# EAGLE design main_module.0.1 (EAGLE 7.7.0)
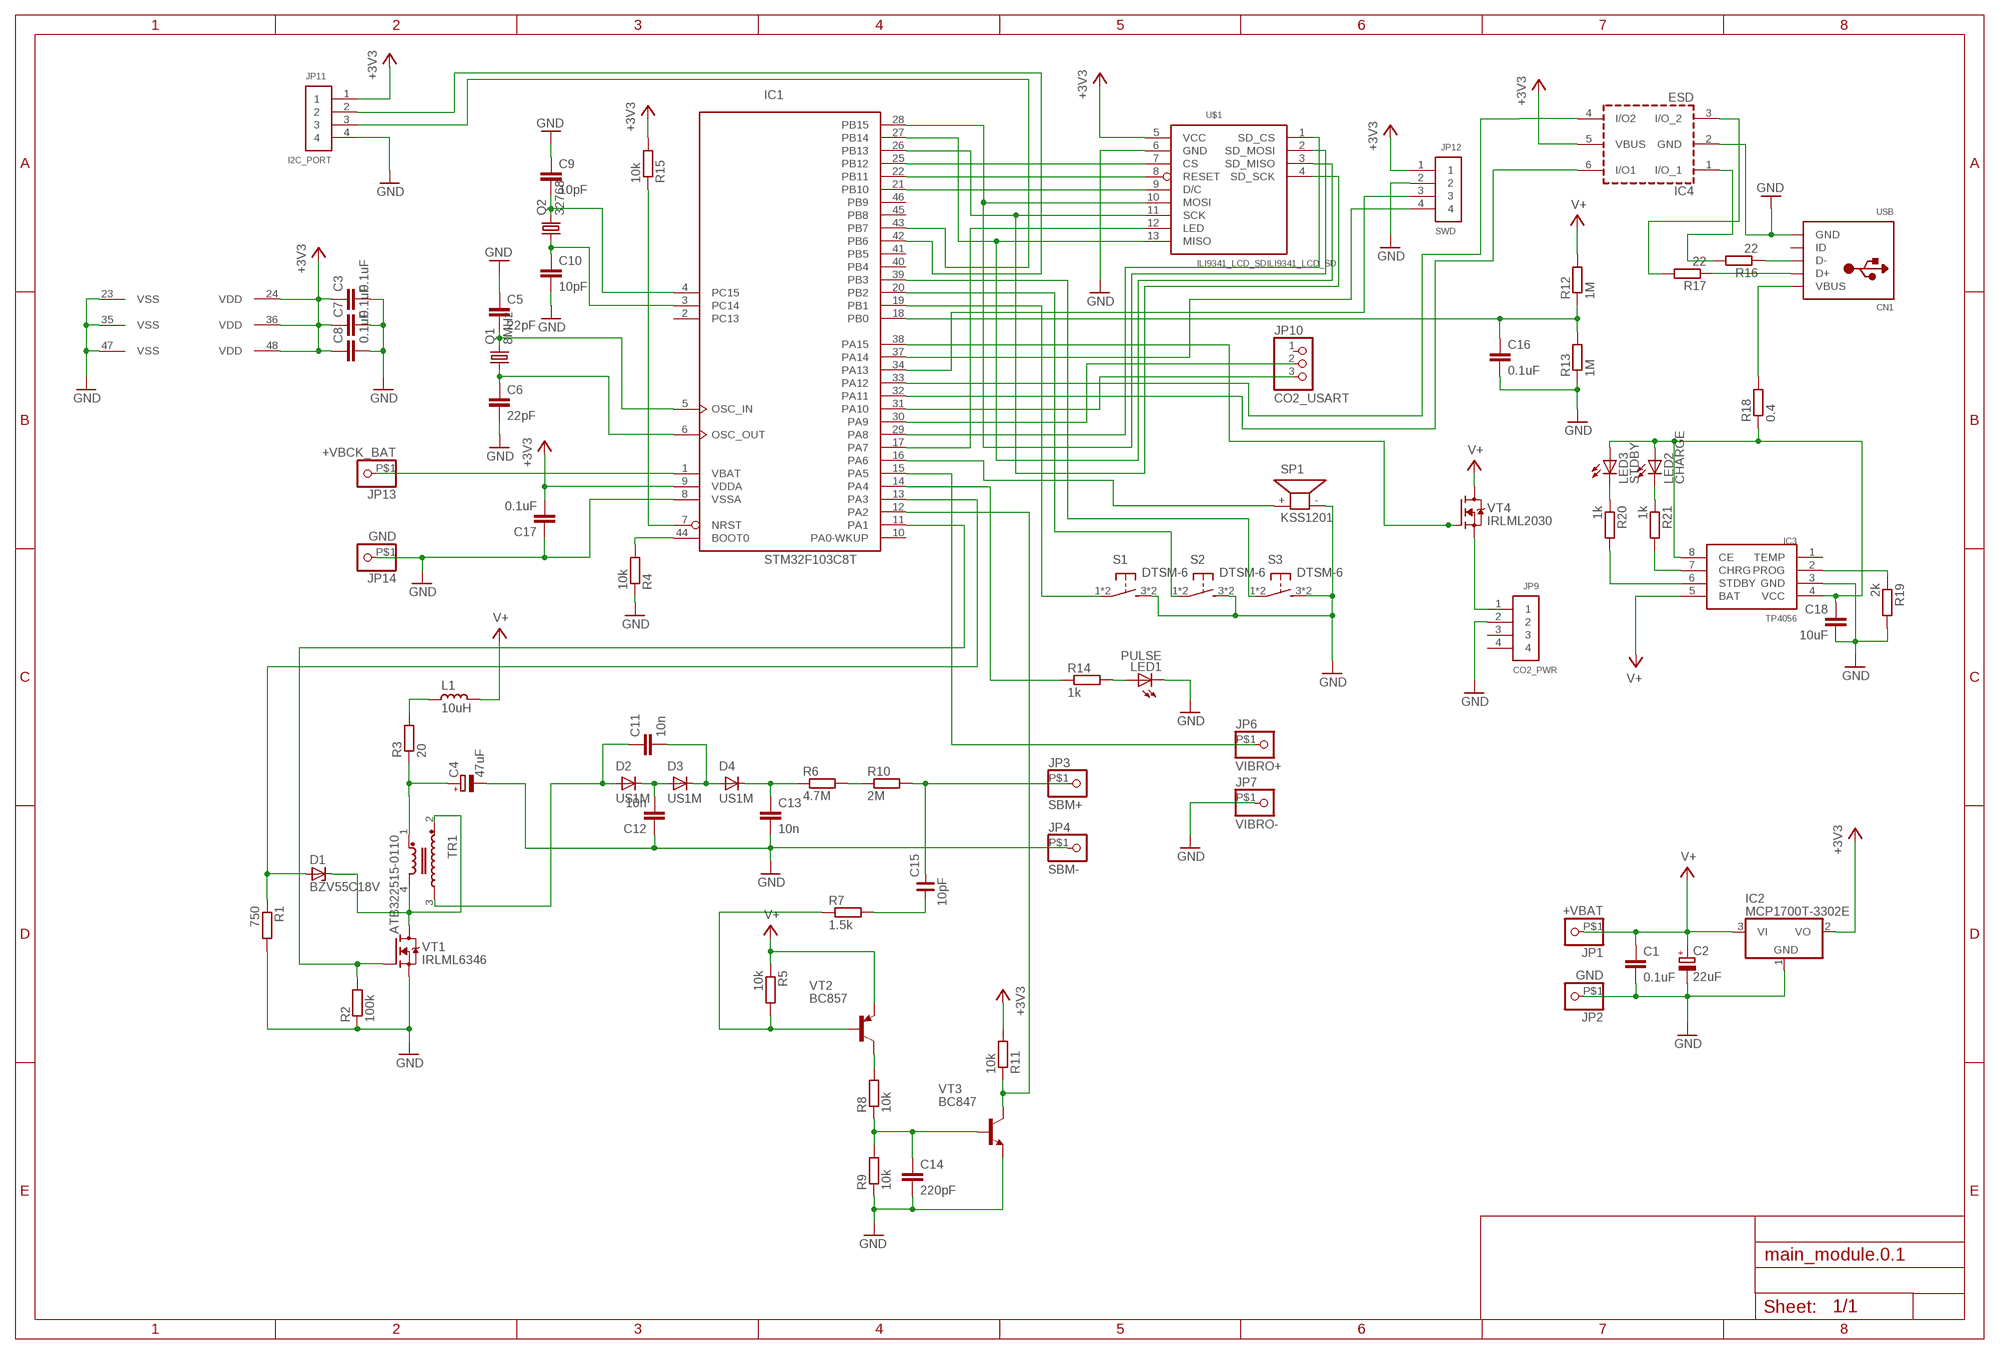
[diagram p0: schematic, sheet 1]

## Parts
C1  0.1uF  C-EUC0805  [C0805]
C2  22uF  CPOL-EUC/6032-28R  [C/6032-28R]
C3  0.1uF  C-EUC0805  [C0805]
C4  47uF  CPOL-EUC/6032-28R  [C/6032-28R]
C5  22pF  C-EUC0805  [C0805]
C6  22pF  C-EUC0805  [C0805]
C7  0.1uF  C-EUC0805  [C0805]
C8  0.1uF  C-EUC0805  [C0805]
C9  10pF  C-EUC0805  [C0805]
C10  10pF  C-EUC0805  [C0805]
C11  10n  C-EUC1206  [C1206]
C12  10n  C-EUC1206  [C1206]
C13  10n  C-EUC1206  [C1206]
C14  220pF  C-EUC0805  [C0805]
C15  10pF  C_1206  [C1206]
C16  0.1uF  C-EUC0805  [C0805]
C17  0.1uF  C-EUC0805  [C0805]
C18  10uF  C-EUC0805  [C0805]
CN1  USB  USBMINIB  [USB-MINIB]
D1  BZV55C18V  ZENER-DIODESOD80C  [SOD80C]
D2  US1M  GF1  [SMA-DO214AC]
D3  US1M  GF1  [SMA-DO214AC]
D4  US1M  GF1  [SMA-DO214AC]
IC1  STM32F103C8T  [LQFP48]
IC2  MCP1700T-3302E  MCP1703CB  [SOT23]
IC3  TP4056  [SOP-8]
IC4  ESD  USBLC6-2SC6  [SOT-23-6L]
JP1  +VBAT  PINHD-1X1-BIGPOGO  [1X1-BIGPOGO]
JP2  GND  PINHD-1X1-BIGPOGO  [1X1-BIGPOGO]
JP3  SBM+  PINHD-1X1-BIGPOGO  [1X1-BIGPOGO]
JP4  SBM-  PINHD-1X1-BIGPOGO  [1X1-BIGPOGO]
JP6  VIBRO+  PINHD-1X1-BIGPOGO  [1X1-BIGPOGO]
JP7  VIBRO-  PINHD-1X1-BIGPOGO  [1X1-BIGPOGO]
JP9  CO2_PWR  1X4-BIG  [1X04-BIG]
JP10  CO2_USART  PINHD-1X3  [1X03]
JP11  I2C_PORT  1X4-BIG  [1X04-BIG]
JP12  SWD  1X4-BIG  [1X04-BIG]
JP13  +VBCK_BAT  PINHD-1X1-BIGPOGO  [1X1-BIGPOGO]
JP14  GND  PINHD-1X1-BIGPOGO  [1X1-BIGPOGO]
L1  10uH  L_0805  [L0805]
LED1  PULSE  LED3MM  [LED3MM]
LED2  CHARGE  LEDCHIP-LED0805  [CHIP-LED0805]
LED3  STDBY  LEDCHIP-LED0805  [CHIP-LED0805]
Q1  8MHz  CRYSTALHC49S  [HC49/S]
Q2  32768  CRYSTALHC49S  [HC49/S]
R1  750  R-EU_M0805  [M0805]
R2  100k  R-EU_M0805  [M0805]
R3  20  R-EU_M0805  [M0805]
R4  10k  R-EU_M0805  [M0805]
R5  10k  R-EU_M0805  [M0805]
R6  4.7M  R-EU_M0805  [M0805]
R7  1.5k  R-EU_M0805  [M0805]
R8  10k  R-EU_M0805  [M0805]
R9  10k  R-EU_M0805  [M0805]
R10  2M  R-EU_M0805  [M0805]
R11  10k  R-EU_M0805  [M0805]
R12  1M  R-EU_M0805  [M0805]
R13  1M  R-EU_M0805  [M0805]
R14  1k  R-EU_M0805  [M0805]
R15  10k  R-EU_M0805  [M0805]
R16  22  R-EU_M0805  [M0805]
R17  22  R-EU_M0805  [M0805]
R18  0.4  R-EU_M1206  [M1206]
R19  2k  R-EU_M0805  [M0805]
R20  1k  R-EU_M0805  [M0805]
R21  1k  R-EU_M0805  [M0805]
S1  DTSM-6  [DTSM-6]
S2  DTSM-6  [DTSM-6]
S3  DTSM-6  [DTSM-6]
SP1  KSS1201  [KSS1201]
TR1  ATB322515-0110  ATB3225  [ATB3225]
U$1  ILI9341_LCD_SDILI9341_LCD_SD  [ILI9341_LCD_SD]
VT1  IRLML6346  MOSFET-N-SOT23  [SOT23]
VT2  BC857  -PNP-SOT23-BCE  [SOT23-BCE]
VT3  BC847  [SOT23]
VT4  IRLML2030  MOSFET-N-SOT23  [SOT23]

## Nets
32OSC_IN: C9.2 IC1.4(PC15) Q2.2
32OSC_OUT: C10.1 IC1.3(PC14) Q2.1
+3V3: C3.1 C7.1 C8.1 C17.2 IC1.9(VDDA) IC1.24(VDD) IC1.36(VDD) IC1.48(VDD) IC2.2(VO) IC4.5(VBUS) JP11.1 JP12.1 R11.2 R15.2 U$1.5(VCC)
+VBCK_BAT: IC1.1(VBAT) JP13.P$1
BATT_CTRL: C16.1 IC1.18(PB0) R12.1 R13.2
CO2_PWR_CONTROL: IC1.38(PA15) VT4.1(G)
GND [power]: C1.2 C2.- C3.2 C4.- C5.1 C6.2 C7.2 C8.2 C9.1 C10.2 C12.1 C13.2 C14.2 C16.2 C17.1 C18.2 CN1.GND IC1.8(VSSA) IC1.23(VSS) IC1.35(VSS) IC1.47(VSS) IC2.1(GND) IC3.3(GND) IC4.2(GND) JP2.P$1 JP4.P$1 JP7.P$1 JP9.2 JP11.4 JP12.2 JP14.P$1 LED1.K(C) R1.2 R2.1 R4.1 R9.1 R13.1 R19.2 S1.3 S1.4 S2.3 S2.4 S3.3 S3.4 SP1.- U$1.6(GND) VT1.2(S) VT3.2(E)
HV_MUL_IN: C11.1 D2.A TR1.3
HV_PULSE: IC1.12(PA2) R11.1 VT3.3(C)
HV_PUMP: IC1.11(PA1) R2.2 VT1.1(G)
HV_TEST: D1.A IC1.13(PA3) R1.1
I2C_SCL: IC1.42(PB6) JP11.2
I2C_SDA: IC1.43(PB7) JP11.3
KEY1: IC1.19(PB1) S1.1 S1.2
KEY2: IC1.20(PB2) S2.1 S2.2
KEY3: IC1.39(PB3) S3.1 S3.2
LCD_BACKLIGHT: IC1.17(PA7) U$1.12(LED)
LCD_CS: IC1.25(PB12) U$1.7(CS)
LCD_RESET: IC1.22(PB11) U$1.8(RESET)
LCD_RS: IC1.21(PB10) U$1.9(D/C)
LED_PULSE: IC1.14(PA4) R14.1
MISO: IC1.27(PB14) U$1.3(SD_MISO) U$1.13(MISO)
MOSI: IC1.28(PB15) U$1.2(SD_MOSI) U$1.10(MOSI)
N$1 [power]: JP9.1 VT4.2(S)
N$3: C12.2 D2.K(C) D3.A
N$4: C11.2 D3.K(C) D4.A
N$5: C13.1 D4.K(C) R6.1
N$6: R6.2 R10.1
N$7: IC1.7(NRST) R15.1
N$8: L1.2 R3.2
N$9: C15.1 R7.2
N$10: C18.1 IC3.4(VCC) IC3.8(CE) LED2.A LED3.A R18.1
N$11: LED1.A R14.2
N$13: R5.2 R7.1 VT2.B
N$14: R8.2 VT2.C
N$15: C14.1 R8.1 R9.2 VT3.1(B)
N$16: C4.+ R3.1 TR1.1
N$18: IC1.44(BOOT0) R4.2
N$19: CN1.D- R16.1
N$20: CN1.D+ R17.1
N$21: IC3.2(PROG) R19.1
N$22: D1.C TR1.2 TR1.4 VT1.3(D)
N$24: IC3.7(CHRG) R21.2
N$25: LED2.C R21.1
N$28: LED3.C R20.1
N$29: IC3.6(STDBY) R20.2
OSC_IN: C5.2 IC1.5(OSC_IN) Q1.2
OSC_OUT: C6.1 IC1.6(OSC_OUT) Q1.1
SBM+: C15.2 JP3.P$1 R10.2
SCK: IC1.26(PB13) U$1.4(SD_SCK) U$1.11(SCK)
SD_CS: IC1.29(PA8) U$1.1(SD_CS)
SOUND: IC1.16(PA6) SP1.+
SWCLK: IC1.37(PA14) JP12.4
SWDIO: IC1.34(PA13) JP12.3
USART_RX: IC1.31(PA10) JP10.3
USART_TX: IC1.30(PA9) JP10.2
USB_DM: IC1.32(PA11) IC4.6(I/O1)
USB_DM_PROT: IC4.1(I/O_1) R16.2
USB_DP: IC1.33(PA12) IC4.4(I/O2)
USB_DP_PROT: IC4.3(I/O_2) R17.2
USB_POWER [power]: CN1.VBUS R18.2
V+ [power]: C1.1 C2.+ IC2.3(VI) IC3.5(BAT) JP1.P$1 L1.1 R5.1 R12.2 VT2.E VT4.3(D)
VIBRO: IC1.15(PA5) JP6.P$1
Unconnected: CN1.ID IC1.2(PC13) IC1.10(PA0-WKUP) IC1.40(PB4) IC1.41(PB5) IC1.45(PB8) IC1.46(PB9) IC3.1(TEMP) JP9.3 JP9.4 JP10.1

## Library data of the parts
C1 C3 C5-C14 C16-C18 = resistor:C-EU: CAPACITOR, European symbol
C2 C4 = resistor:CPOL-EU: POLARIZED CAPACITOR, European symbol
C15 = rc-master-smd:C_: NON-POLARIZED CAP
CN1 = adafruit:USB: USB Connectors USBMINIB - Surface Mount Female Mini-B USB Connector 4UConnector: 06564 By microbuilder.eu Thru-hole RA Female Mini-B USB Connector 4UConnector: 18732 By ladyada.net
D1 = diode:ZENER-DIODE: Z-Diode
D2-D4 = diode:GF1: DIODE
IC1 = micro-stm_v3:STM32F103C*T: ARM 32-bit Cortex™-M3 CPU 72 MHz maximum frequency 16 to 128 Kbytes of Flash memory 6 to 20 kbytes of SRAM 37 GPIOs 2.0 to 3.6 V application supply
IC2 = linear:MCP1703: 250 mA, 16V, Low Quiescent Current LDO Regulator Source: http://ww1.microchip.com/downloads/en/DeviceDoc/22049b.pdf
IC3 = TP4056:TP4056
IC4 = usblc6:USBLC6-2: VERY LOW CAPACITANCE ESD PROTECTION 2 line Datasheet link <http://www.st.com/web/catalog/sense_power/FM114/CL1137/SC1489/PF93353>
JP1-JP4 JP6 JP7 JP13 JP14 = adafruit:PINHD-1X1: Pin header 1x1 for 0.1" spacing With round pins
JP9 JP11 JP12 = adafruit:1X4: 4-pin connector
JP10 = adafruit:PINHD-1X3: PIN HEADER
L1 = rc-master-smd:L_: INDUCTOR
LED1 = adafruit:LED: LED
LED2 LED3 = led:LED: LED
Q1 Q2 = crystal:CRYSTAL: CRYSTAL; OC_FARNELL: 1667008; OC_NEWARK: unknown
R1-R21 = resistor:R-EU_: RESISTOR, European symbol
S1-S3 = switch-tact:DTSM-6
SP1 = buzzer:KSS1201: SPEAKER Source: Schukat; OC_FARNELL: unknown; OC_NEWARK: unknown
TR1 = atb3225-tdk:ATB3225
U$1 = ili9341:ILI9341_LCD_SD: ILI9341 2.2" LCD board with SD-Card holder
VT1 VT4 = we-transistor:MOSFET-N: N-Channel MOSFET TSM3404, IRLML2502 (Vgs>=+/-20V, Vds>=20V, Id>=3A + Rds<=0.05Ohm @ Vgs=4.5V) BSS138 (Vgs>=+/-20V, Vds>=40V, Id>=0.2A + Rds<=3Ohm @ Vgs=4.5V)
VT2 = transistor:*-PNP-: PNP Transistror
VT3 = transistor:BC847: NPN TRANSISTOR

## Net classes
0 default: clearance 0.152 mm
1 power: width 0.508 mm, clearance 0.152 mm to class 0, clearance 0.152 mm

## Board
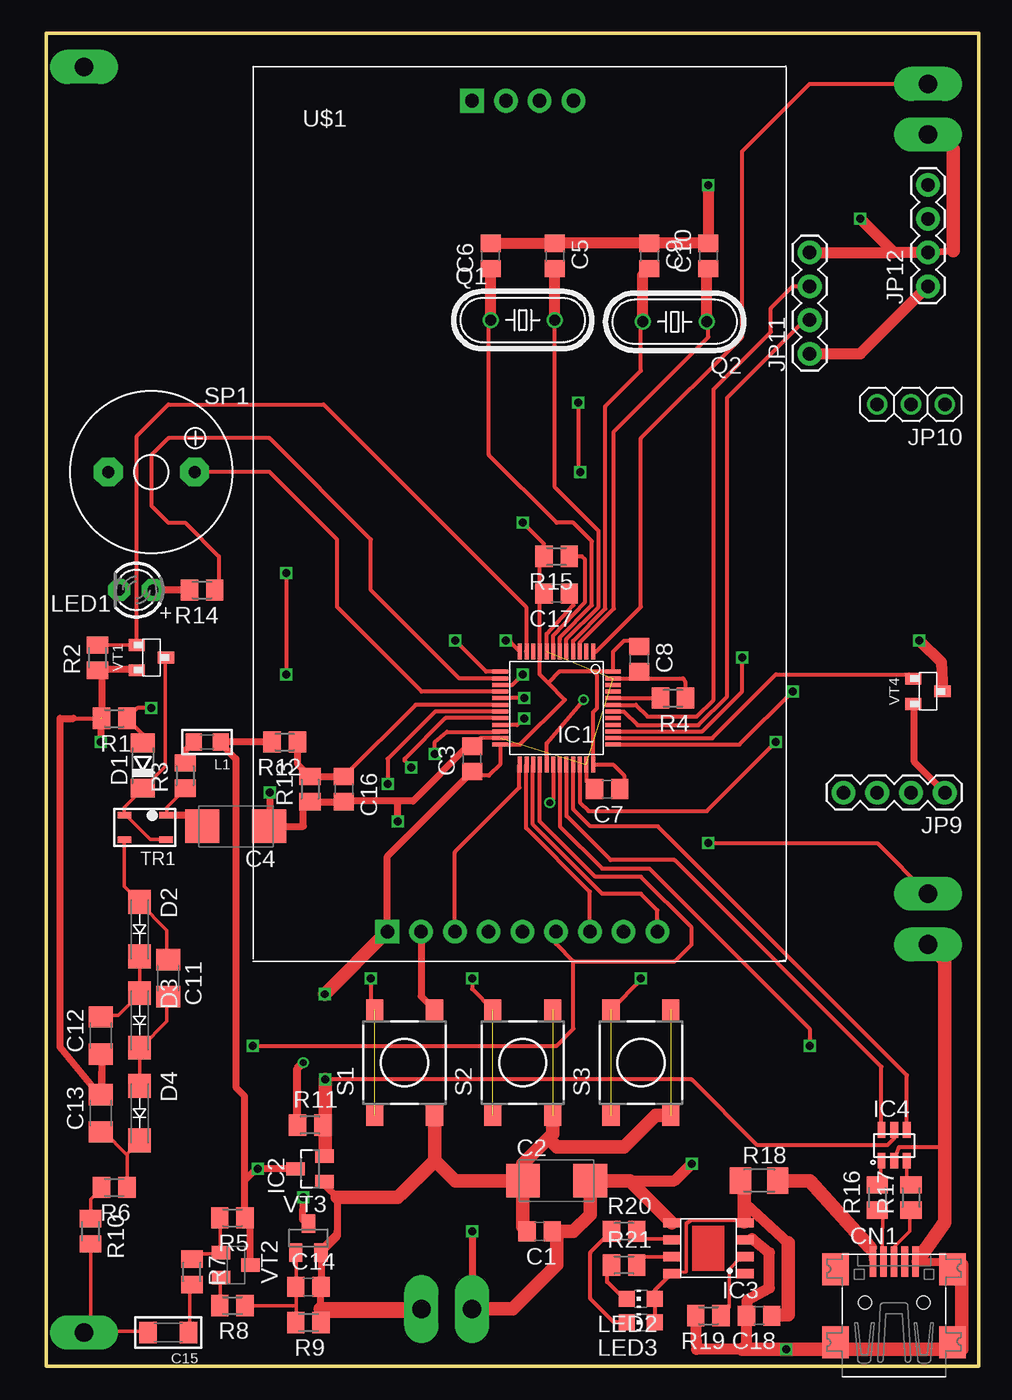
[diagram p1: board, top side]
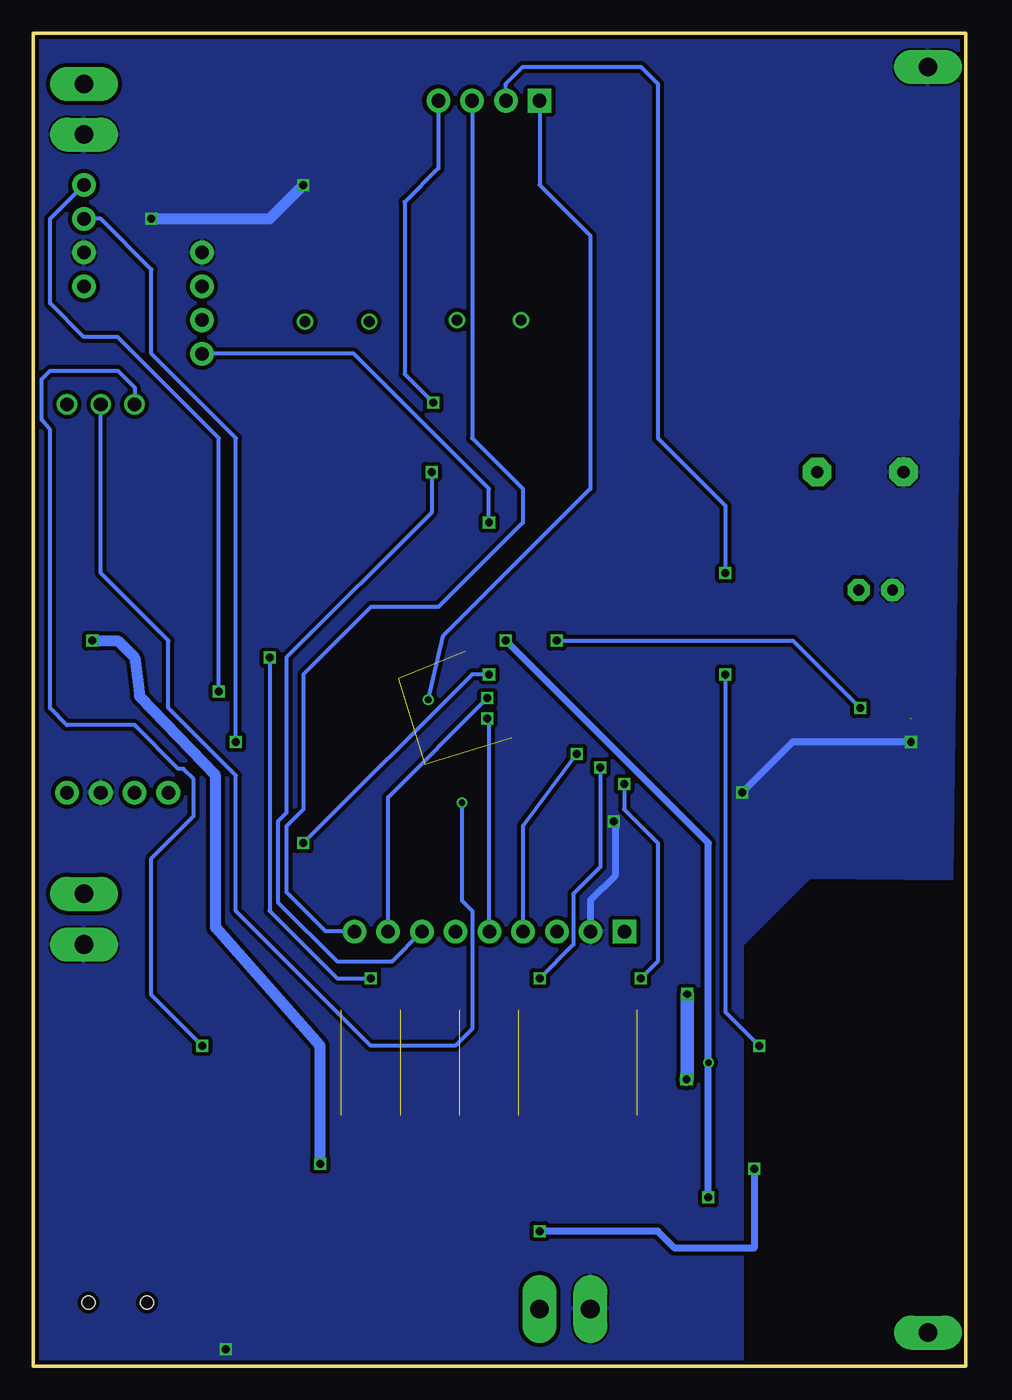
[diagram p2: board, bottom side, seen from below]

Size 70.16 x 100.31 mm. Coordinates in mm from the lower left corner, seen from the top.
Outline: 70.16,0 70.16,100.31 0,100.31 0,0 70.16,0
Copper layers (1*16): Top 0.035mm / dielectric 1.6mm / Bottom 0.035mm
Design rules "LUT *": minimum track width 6mil, minimum drill 0.5mm, track to track 6mil, track to pad 6mil, pad to pad 6mil, via to via 6mil, smd to smd 0mil, copper to edge 6mil, drill to drill 6mil, minimum pad ring 6mil, minimum via ring 6mil, stop-mask expansion 4mil, vias tented up to drill 0mil, thermal gap 6mil

### Footprints (pad centres in the part's own frame; a part is rotated, then mirrored left to right if it is on the bottom)
C0805 = smd 1.3 x 1.5: 1 -0.95,0; 2 0.95,0
C/6032-28R = smd 2.55 x 2.5: + 2.525,0; - -2.525,0
C1206 = smd 1.6 x 1.8: 1 -1.4,0; 2 1.4,0
C1206' = smd 1.3 x 1.6: 1 -1.524,0; 2 1.524,0
USB-MINIB = smd 0.5 x 2.308: D+ 0,4.064; D- -0.8,4.064; GND 1.6,4.064; ID 0.8,4.064; VBUS -1.6,4.064 | smd 2 x 2.4: GND1 -4.4,-2; GND2 -4.4,3.5; GND3 4.4,3.5; GND4 4.4,-2 | hole 1: -2.2,1; 2.2,1
SOD80C = smd 1.4 x 1.8: A 1.7,0; C -1.7,0
SMA-DO214AC = smd 1.8 x 1.7: A -2.05,0; K 2.05,0
LQFP48 = smd 0.3 x 1.2: 1 -2.75,-4.25; 2 -2.25,-4.25; 3 -1.75,-4.25; 4 -1.25,-4.25; 5 -0.75,-4.25; 6 -0.25,-4.25; 7 0.25,-4.25; 8 0.75,-4.25; 9 1.25,-4.25; 10 1.75,-4.25; 11 2.25,-4.25; 12 2.75,-4.25; 25 2.75,4.25; 26 2.25,4.25; 27 1.75,4.25; 28 1.25,4.25; 29 0.75,4.25; 30 0.25,4.25; 31 -0.25,4.25; 32 -0.75,4.25; 33 -1.25,4.25; 34 -1.75,4.25; 35 -2.25,4.25; 36 -2.75,4.25 | smd 1.2 x 0.3: 13 4.25,-2.75; 14 4.25,-2.25; 15 4.25,-1.75; 16 4.25,-1.25; 17 4.25,-0.75; 18 4.25,-0.25; 19 4.25,0.25; 20 4.25,0.75; 21 4.25,1.25; 22 4.25,1.75; 23 4.25,2.25; 24 4.25,2.75; 37 -4.25,2.75; 38 -4.25,2.25; 39 -4.25,1.75; 40 -4.25,1.25; 41 -4.25,0.75; 42 -4.25,0.25; 43 -4.25,-0.25; 44 -4.25,-0.75; 45 -4.25,-1.25; 46 -4.25,-1.75; 47 -4.25,-2.25; 48 -4.25,-2.75
SOT23 = smd 1 x 1.4: 1 -0.95,-1.1; 2 0.95,-1.1; 3 0,1.1
SOP-8 = smd 1.3 x 0.7: 1 -2.75,1.905; 2 -2.75,0.635; 3 -2.75,-0.635; 4 -2.75,-1.905; 5 2.75,-1.905; 6 2.75,-0.635; 7 2.75,0.635; 8 2.75,1.905
SOT-23-6L = smd 0.6 x 1.2: 1 -0.95,-2.3; 2 0,-2.3; 3 0.95,-2.3; 4 0.95,0; 5 0,0; 6 -0.95,0
1X1-BIGPOGO = drill 1.4 pad 2.54 long: P$1 0,0
1X04-BIG = drill 1.016 pad 1.778: 1 0,0; 2 2.54,0; 3 5.08,0; 4 7.62,0
1X03 = drill 1.016: 1 -2.54,0; 2 0,0; 3 2.54,0
L0805 = smd 1.2 x 1.3: 1 -1.016,0; 2 1.016,0
LED3MM = drill 0.813 pad 1.676 octagon: A -1.27,0; K 1.27,0
CHIP-LED0805 = smd 1.2 x 1.2: A 0,-1.05; C 0,1.05
HC49/S = drill 0.813: 1 -2.413,0; 2 2.413,0
M0805 = smd 1.3 x 1.6: 1 -0.95,0; 2 0.95,0
M1206 = smd 1.6 x 2: 1 -1.4,0; 2 1.4,0
DTSM-6 = smd 1.55 x 1.3: 1 -3.975,2.25; 2 3.975,2.25; 3 -3.975,-2.25; 4 3.975,-2.25
KSS1201 = drill 0.914 pad 2.159 octagon: + 3.251,0; - -3.251,0
ATB3225 = smd 1.016 x 0.508: 1 -3.65,0.43; 2 -3.65,2.27; 3 -0.5,2.27; 4 -0.5,0.43
ILI9341_LCD_SD = drill 1.016 pad 1.778 square: 1 1.27,1.27; 5 -5.11,-61.26 | drill 1.016 pad 1.778: 2 3.81,1.27; 3 6.35,1.27; 4 8.89,1.27; 6 -2.57,-61.26; 7 -0.03,-61.26; 8 2.51,-61.26; 9 5.05,-61.26; 10 7.59,-61.26; 11 10.13,-61.26; 12 12.67,-61.26; 13 15.21,-61.26
SOT23' = smd 1.3 x 0.9: 1 -1.1,0.95; 2 -1.1,-0.95; 3 1.1,0
SOT23-BCE = smd 1 x 1.4: B -0.95,-1.1; C 0.95,-1.1; E 0,1.1

### Placement (x,y rotation side)
C1  37.13,10.16 180 top
C2  38.4,13.97 0 top
C3  32.05,45.72 90 top
C4  14.28,40.64 180 top
C5  38.28,83.57 270 top
C6  33.45,83.57 90 top
C7  42.21,43.43 180 top
C8  44.63,53.21 270 top
C9  45.39,83.57 270 top
C10  49.83,83.57 90 top
C11  9.2,29.21 270 top
C12  4.12,24.89 90 top
C13  4.12,19.05 90 top
C14  19.74,5.97 0 top
C15  10pF  [C1206']  9.2,2.54 180 top
C16  22.4,43.43 270 top
C17  38.4,58.17 180 top
C18  53.64,3.81 180 top
CN1  63.8,3.81 0 top
D1  7.29,45.21 90 top
D2  7.04,32.89 270 top
D3  7.04,26.04 270 top
D4  7.04,19.05 270 top
IC1  38.4,49.53 180 top
IC2  19.86,14.86 90 top
IC3  49.83,8.89 180 top
IC4  63.8,17.78 0 top
JP1  32.05,4.32 90 top
JP2  28.25,4.32 90 top
JP3  2.85,2.54 180 top
JP4  2.85,97.79 180 top
JP6  66.34,35.56 180 top
JP7  66.34,31.75 180 top
JP9  67.61,43.18 180 top
JP10  65.08,72.39 180 top
JP11  57.45,76.2 90 top
JP12  66.34,81.28 90 top
JP13  66.34,96.52 180 top
JP14  66.34,92.71 180 top
L1  12.12,46.99 180 top
LED1  6.78,58.42 180 top
LED2  44.75,5.08 90 top
LED3  44.75,3.3 90 top
Q1  35.86,78.74 0 top
Q2  47.29,78.61 180 top
R1  5.13,48.77 180 top
R2  3.86,53.34 90 top
R3  10.46,44.45 90 top
R4  47.17,50.29 180 top
R5  14.02,11.18 180 top
R6  5.13,13.46 180 top
R7  10.97,7.11 270 top
R8  14.02,4.57 180 top
R9  19.74,3.3 180 top
R10  3.35,10.16 270 top
R11  19.86,18.16 0 top
R12  17.96,46.99 180 top
R13  19.86,43.43 90 top
R14  11.73,58.42 180 top
R15  38.4,60.96 180 top
R16  62.53,12.7 90 top
R17  65.08,12.7 90 top
R18  53.64,13.97 0 top
R19  49.83,3.81 180 top
R20  43.48,10.16 0 top
R21  43.48,7.62 0 top
S1  26.98,22.86 90 top
S2  35.86,22.86 90 top
S3  44.75,22.86 90 top
SP1  7.93,67.31 0 top
TR1  5.38,41.91 180 top
U$1  30.79,93.98 0 top
VT1  IRLML6346  [SOT23']  7.93,53.34 0 top
VT2  14.28,7.62 270 top
VT3  19.74,9.65 0 top
VT4  IRLML2030  [SOT23']  66.34,50.8 0 top

### Tracks (layer width: path | path; a pad name or v marks a point on that pad's centre or on a via)
32OSC_IN
  Top 0.305: IC1.4 39.65,54.59 42.09,57.02 42.09,72.26 44.75,74.93 44.75,78.49 Q2.2
  Top 0.813: Q2.2 44.88,82.11 C9.2
32OSC_OUT
  Top 0.305: IC1.3 40.15,54.45 42.72,57.02 42.72,70.36 49.83,77.47 49.83,78.49 Q2.1
  Top 0.813: Q2.1 49.71,82.49 C10.1
+3V3  (via drill 0.6)
  Top 0.305: C3.1 32.38,44.45 33.32,44.45 34.15,45.28 IC1.24 35.65,46.78 39.04,50.16 37.77,51.44 | C7.1 43.48,43.75 43.48,44.45 42.65,45.28 IC1.36 41.15,49.23 41.45,49.53 41.45,52.03 41.2,52.28 | C8.1 44.18,54.61 43.48,54.61 42.65,53.78 IC1.48 41.2,52.28 | 37.15,57.87 IC1.9 37.13,53.76 37.13,52.07 37.77,51.44 | 37.15,57.87 C17.2 | 41.2,52.28 38.61,52.28 37.77,51.44 | 37.15,57.87 37.15,60.66 R15.2 37.45,61.91 v35.86,63.5 | IC4.5 63.8,17.14 63.3,16.64 53.52,16.64 48.56,21.59 v21.01,21.59
  Top 0.406: IC2.2 20.81,15.81 R11.2
  Top 0.508: U$1.5 25.68,38.39 C3.1
  Top 0.813: JP11.1 61.26,76.2 JP12.1
  Top 1.016: v20.96,28.01 U$1.5 | v21.01,21.59 21.01,15.85 IC2.2
  Bottom 0.305: v35.86,63.5 35.86,66.04 46.02,76.2 JP11.1
  Bottom 1.016: v20.96,28.01 20.96,21.63 v21.01,21.59
+VBCK_BAT
  Top 0.305: IC1.1 41.38,53.78 44.75,57.15 44.75,69.85 52.38,77.47 52.38,91.44 57.45,96.52 JP13.P$1
BATT_CTRL
  Top 0.305: IC1.18 27.8,49.78 C16.1
  Top 0.508: R12.1 18.91,45.34 R13.2 C16.1
CO2_PWR_CONTROL
  Top 0.305: IC1.38 50.12,47.28 54.91,52.07 64.92,52.07 VT4.1
GND  (via drill 0.6)  (6 unrouted)
  Top 0.305: IC1.23 32.66,47.28 C3.2 | IC1.35 40.65,44.04 C7.2 | C8.2 44.14,51.78 IC1.47 47.93,51.78 48.12,51.46 R4.1 | IC1.8 37.65,55.13 39.67,57.28 39.67,57.85 C17.1 | R1.2 4.18,49.46 | 67.63,30.8 67.3,30.8 | IC4.2 64.19,16.51 67.63,16.51 | 4.15,22.12 4.15,22.06 | 29.26,18.85 S1.3 29.23,14.95 26.98,12.7 21.89,12.7 | 35.86,15.24 35.86,13.98 C2.- | 21.89,10.16 20.62,8.89 20.62,3.81 28.25,3.81 | 2.08,48.77 4.12,48.77 4.24,48.9 | 4.18,20.46 4.18,21.53 4.12,21.59
  Top 0.508: R9.1 20.64,3.31 20.64,4.34 20.64,5.71 C14.2 20.75,6.06 20.75,8.46 VT3.2 21.89,9.76 21.89,10.16 21.89,12.7 20.96,13.63 IC2.1 | 28.18,4.34 JP2.P$1 | 4.18,20.46 4.18,23.43 C12.1 | 4.18,20.46 C13.2 4.15,22.12 | 53.1,9.61 52.64,9.49 IC3.3 | 52.76,3.89 C18.2 | 48.98,3.43 48.98,3.77 R19.2 | 52.76,3.66 C18.2 | 65.7,8.14 CN1.GND | 52.87,3.43 C18.2 | 2.92,97.73 JP4.P$1 | VT1.2 6.81,52.46 3.95,52.46 R2.1 | R1.2 4.18,48.81 4.18,52.23 R2.1 | 3.61,52.35 R2.1 | 52.69,1.59 52.38,1.27 | C3.2 31.74,46.67 27.61,42.55 26.47,42.55 | 26.47,42.55 22.46,42.55 C16.2 R13.1 19.36,41.98 19.36,40.64 C4.- 16.82,40.66 v16.82,43.18 | JP12.2 68.25,83.95 | U$1.6 28.21,27.84 S1.4 | 4.18,20.46 3.98,20.46 1.07,24 1.07,48.77 2.08,48.77 | 68.63,7.87 68.88,7.62 | v26.47,41.02 26.47,42.55 | 4.12,48.77 v4.12,46.99
  Top 0.61: CN1.GND 68.63,7.87
  Top 0.813: 53.1,9.61 54.42,8.55 54.42,5.91 52.76,5 52.76,3.89 | C18.2 52.69,1.59 | 52.38,1.27 48.95,1.27 48.88,2.22 R19.2 | C6.2 C5.1 C9.1 C10.2 v49.83,88.9 | JP12.2 63.8,83.82 | 63.8,83.82 v61.26,86.36 | JP11.4 63.8,83.82
  Top 1.016: 28.18,4.34 20.64,4.34 | 67.63,30.8 67.63,16.51 67.63,10.83 65.7,8.14 | JP14.P$1 67.61,92.71 68.25,91.57 68.25,83.95 | 67.3,30.8 JP7.P$1 | 21.89,12.7 26.47,12.7 29.26,15.49 | 29.26,15.49 29.26,18.85 | C2.- 30.79,13.97 29.26,15.49 | S2.3 38.11,17.49 37.77,17.14 | 37.77,17.14 35.86,15.24 | S3.3 45.86,18.89 43.48,16.51 38.4,16.51 37.77,17.14 | 68.88,7.62 68.88,1.27 v55.68,1.27 52.38,1.27 | 35.86,13.98 35.86,10.48 C1.2
  Bottom 0.508: U$1.6 28.21,35.08 26.34,36.96 26.34,40.89 v26.47,41.02 | v4.12,46.99 13.01,46.99 v16.82,43.18
  Bottom 0.813: v61.26,86.36 52.38,86.36 v49.83,88.9
  pour Bottom (isolate 0.305): 0.18,100.33 70.16,100.33 70.16,0 16.82,0 16.82,31.75 11.73,36.83 1.07,36.7
HV_MUL_IN
  Top 0.254: TR1.3 5.89,39.55 5.89,36.12 7.04,34.98 D2.A 7.04,34.86 9.09,32.8 9.09,30.63 C11.1
HV_PULSE  (via drill 0.5, 0.6)
  Top 0.254: 19.84,10.86 VT3.3
  Top 0.305: 34.82,54.61 IC1.12
  Top 0.508: VT3.3 19.31,11.05 v19.36,12.7 | v34.59,54.61 34.82,54.61
  Top 0.61: R11.1 18.91,22.42 v19.36,22.86
  Bottom 0.508: v19.36,12.7 v19.36,22.86 19.36,39.37 v34.59,54.61
HV_PUMP
  Top 0.254: R2.2 3.95,54.29 6.81,54.29 VT1.1
  Top 0.305: 6.83,59.86 VT1.1 6.83,70.02 9.2,72.39 20.88,72.39 36.12,57.15 36.12,53.82 IC1.11
  Top 0.508: 6.66,54.46 VT1.1
HV_TEST  (via drill 0.6)
  Top 0.305: D1.A 7.29,47.56 R1.1 6.84,49.53 v7.93,49.53 | IC1.13 33.11,52.28 v30.79,54.61
  Bottom 0.305: v30.79,54.61 13.01,54.61 v7.93,49.53
I2C_SCL
  Top 0.305: IC1.42 43.48,49.28 44.5,48.26 49.07,48.26 51.23,50.42 51.23,72.9 57.07,78.74 JP11.2
I2C_SDA
  Top 0.305: IC1.43 44.38,49.78 45.26,48.9 48.95,48.9 50.22,50.16 50.22,73.53 54.53,77.85 54.53,79.63 56.18,81.28 JP11.3
KEY1  (via drill 0.6)  (1 unrouted)
  Top 0.305: IC1.19 29.27,49.28 25.71,45.72 v25.71,43.81 | v24.43,29.21 24.43,27.12 S1.2
  Bottom 0.305: v25.71,43.81 25.71,41.91 23.16,39.37 23.16,30.48 v24.43,29.21
KEY2  (via drill 0.6)  (1 unrouted)
  Top 0.305: IC1.20 30.04,48.78 26.98,45.72 26.98,45.59 v27.48,45.09 | v32.05,29.21 32.05,28.39 S2.2
  Bottom 0.305: v27.48,45.09 27.48,37.59 29.52,35.56 29.52,31.75 v32.05,29.21
KEY3  (via drill 0.6)  (1 unrouted)
  Top 0.305: IC1.39 49.35,47.78 52.38,50.8 v52.38,53.34 | v44.75,29.21 44.75,29.09 S3.2
  Bottom 0.305: v52.38,53.34 52.38,34.29 47.29,29.21 v44.75,29.21
LCD_BACKLIGHT  (via drill 0.6)  (1 unrouted)
  Top 0.305: v35.99,50.29 34.17,50.29 IC1.17
  Bottom 0.305: 43.45,32.74 43.45,42.83 v35.99,50.29
LCD_CS
  Top 0.305: U$1.7 30.75,38.7 35.61,43.56 35.61,45.24 IC1.25
LCD_RESET  (via drill 0.6)
  Top 0.305: v29.26,46.1 29.26,46.99 30.15,47.75 34.13,47.75 IC1.22
  Bottom 0.305: v29.26,46.1 33.29,40.67 U$1.8
LCD_RS  (via drill 0.6)
  Top 0.305: v35.99,48.77 35.44,48.26 IC1.21
  Bottom 0.305: U$1.9 35.83,48.23 v35.99,48.77
LED_PULSE
  Top 0.305: IC1.14 31.07,51.78 24.43,58.42 24.43,62.23 16.82,69.85 9.2,69.85 7.93,68.58 7.93,64.77 9.2,63.5 10.46,63.5 13.01,60.96 13.01,58.74 R14.1
MISO
  Top 0.305: U$1.13 45.99,34.32 44.75,35.56 41.83,35.56 36.63,40.77 36.63,45.25 IC1.27
  Bottom 0.305: U$1.3 37.13,69.85 33.32,66.04 33.32,63.5 39.67,57.15 44.75,57.15 49.83,52.07 49.83,41.91 51.1,40.64 51.1,35.69 48.18,32.77 46.04,32.77 U$1.13
MOSI  (via drill 0.6)
  Top 0.305: U$1.10 38.38,31.78 39.67,30.48 | 39.67,30.48 47.29,30.48 48.56,31.75 48.56,33.02 44.75,36.83 41.33,36.83 37.13,41.02 37.13,45.26 IC1.28 | v18.09,59.69 v18.09,52.07 | v15.55,24.13 38.4,24.13 39.67,25.4 39.67,30.48
  Bottom 0.305: U$1.2 34.59,96.52 33.32,97.79 24.43,97.79 23.16,96.52 23.16,69.85 18.09,64.77 v18.09,59.69 | v18.09,52.07 18.09,26.67 v15.55,24.13
N$1
  Top 0.508: VT4.2 65.33,49.84 65.33,45.49 67.61,43.2 JP9.1
N$3
  Top 0.254: C12.2 4.18,26.4 5.44,26.4 7.04,28 D3.A D2.K
N$4
  Top 0.254: D4.A D3.K 7.15,24 9.09,25.95 9.09,27.77 C11.2
N$5
  Top 0.254: 6.12,16 6.12,13.49 R6.1 | 6.12,16 7.04,16.92 D4.K | C13.1 4.18,17.6 4.41,17.6 6.01,16 6.12,16
N$6
  Top 0.254: R10.1 3.38,11.2 3.38,12.57 4.18,13.37 R6.2
N$7
  Top 0.305: IC1.7 38.15,54.99 40.56,57.53 40.56,60.71 40.31,60.96 R15.1
N$8
  Top 0.508: R3.2 10.46,46.35 L1.2
N$9
  Top 0.254: C15.1 10.81,2.63 10.81,5.94 10.92,6.06 R7.2
N$10
  Top 0.254: 52.53,13.72 52.3,13.95 R18.1 | 52.53,10.86 IC3.4 | 52.64,12.24 IC3.4 | IC3.8 47.15,7.09 47.38,7.09 48.17,7.11 48.17,10.74 48.53,10.97 52.41,10.97 IC3.4
  Top 0.305: IC3.8 45.8,5.71 LED2.A LED3.A
  Top 0.813: 52.64,12.24 55.85,9.28
  Top 1.016: 52.53,13.72 52.53,10.86 | 55.85,9.28 55.85,3.89 C18.1
N$11
  Top 0.508: R14.2 LED1.A
N$13
  Top 0.254: R7.1 11.04,8.12 11.38,8.46 13.09,8.46 VT2.B 13.09,8.57 13.09,11.09 R5.2
N$14
  Top 0.254: VT2.C 13.09,6.63 13.09,4.57 R8.2
N$15
  Top 0.254: VT3.1 18.81,8.46 18.81,6.06 C14.1 18.81,5.94 18.81,4.57 | 18.81,4.57 18.81,3.31 R9.2 | 18.81,4.57 R8.1
N$16
  Top 0.254: TR1.1 9.09,41.49 9.09,42.06 10.46,43.43 R3.1
  Top 0.508: 9.09,41.49 10.88,41.49 C4.+
N$18
  Top 0.305: IC1.44 46.59,50.28 R4.2
N$19
  Top 0.254: R16.1 62.59,11.66 62.97,11.66 62.93,9.03 62.93,7.89 CN1.D-
N$20
  Top 0.254: R17.1 64.99,11.66 64.99,10.17 63.84,9.03 63.84,7.89 CN1.D+
N$21
  Top 0.254: IC3.2 52.53,8.23 52.3,8.23 51.38,7.32 51.38,4.46 50.81,3.89 R19.1
N$22
  Top 0.254: TR1.2 8.98,39.66 7.84,39.66 6.01,41.49 TR1.4 5.89,42.06 7.27,43.43 D1.C 7.38,43.55 8.98,45.15 8.98,53.26 VT1.3
N$24
  Top 0.254: IC3.7 47.04,8.23 45.1,8.23 44.53,7.66 R21.2
N$25
  Top 0.305: LED2.C 43.48,5.08 42.21,6.35 42.21,7.3 R21.1
N$28
  Top 0.305: LED3.C 42.72,3.3 40.94,5.08 40.94,8.57 R20.1
N$29
  Top 0.254: IC3.6 47.04,9.6 44.98,9.6 44.53,10.06 R20.2
OSC_IN
  Top 0.305: IC1.5 39.15,54.73 41.58,57.15 41.58,62.87 38.28,66.17 Q1.2
  Top 0.813: Q1.2 C5.2
OSC_OUT
  Top 0.305: IC1.6 38.65,54.73 38.66,54.74 38.66,54.86 41.07,57.28 41.07,62.1 39.67,63.5 38.4,63.5 33.32,68.58 33.32,78.61 Q1.1
  Top 0.813: Q1.1 C6.1
SBM+
  Top 0.254: C15.2 7.61,2.63 2.92,2.63 JP3.P$1 3.38,2.74 3.38,9.14 R10.2
SCK  (via drill 0.6)
  Top 0.305: U$1.11 40.91,35.72 36.12,40.51 36.12,45.24 IC1.26 | v40.06,72.52 40.06,67.44 v40.18,67.31
  Bottom 0.305: U$1.4 39.67,90.17 42.21,87.63 42.21,74.68 v40.06,72.52 | v40.18,67.31 40.18,64.26 51.1,53.34 51.1,41.66 51.74,41.02 51.74,34.92 47.29,30.48 43.15,30.48 U$1.11
SD_CS  (via drill 0.5)
  Top 0.305: IC1.29 37.65,46.88 v40.44,50.16
  Bottom 0.305: U$1.1 32.05,88.9 28.25,85.09 28.25,66.04 39.29,54.99 v40.44,50.16
SOUND
  Top 0.305: IC1.16 28.27,50.78 21.89,57.15 21.89,62.23 16.82,67.31 SP1.+
SWCLK  (via drill 0.6)
  Top 0.305: IC1.37 52.16,46.78 v56.18,50.8
  Bottom 0.305: v56.18,50.8 56.18,69.85 63.8,77.47 66.34,77.47 68.88,80.01 68.88,86.36 JP12.4
SWDIO  (via drill 0.6)
  Top 0.305: IC1.34 40.15,42.45 40.82,41.78 49.71,41.78 v54.91,46.99
  Bottom 0.305: v54.91,46.99 54.91,69.85 61.26,76.2 61.26,82.55 65.08,86.36 JP12.3
USART_RX  (via drill 0.6)
  Top 0.305: IC1.31 38.65,40.64 41.83,37.47 45.39,37.47 57.45,25.4 v57.45,24.13
  Bottom 0.305: v57.45,24.13 61.26,27.94 61.26,38.23 58.09,41.4 58.09,44.2 58.85,44.96 59.23,44.96 62.53,48.26 67.61,48.26 68.88,49.53 68.88,70.48 69.52,71.25 69.52,74.3 68.88,74.93 63.8,74.93 62.53,73.66 JP10.3
USART_TX  (via drill 0.5)
  Top 0.305: IC1.30 38.15,42.68 v37.9,42.42
  Bottom 0.305: v37.9,42.42 37.9,35.05 37.13,34.29 37.13,25.4 38.4,24.13 44.75,24.13 54.91,34.29 54.91,44.45 59.99,49.53 59.99,54.61 65.08,59.69 JP10.2
USB_DM
  Top 0.305: IC4.6 62.85,22.54 47.29,38.1 42.47,38.1 39.17,41.4 39.17,45.27 IC1.32
USB_DM_PROT
  Top 0.254: IC4.1 62.81,15.43 62.81,13.95 62.59,13.72 R16.2
USB_DP
  Top 0.305: IC4.4 64.75,21.91 46.02,40.64 40.94,40.64 39.67,41.91 39.67,45.26 IC1.33
USB_DP_PROT
  Top 0.254: IC4.3 64.76,15.43 64.76,13.95 64.99,13.72 R17.2
USB_POWER
  Top 0.508: 55.16,13.95 R18.2 | 62,8.9 CN1.VBUS
  Top 1.016: 55.16,13.95 57.47,13.95 62,8.9
V+  (via drill 0.6)
  Top 0.305: 38.4,9.84 C1.1
  Top 0.508: 14.92,13.97 14.92,20.34 14.28,20.99 14.28,45.72 13.13,46.86 L1.1 R12.2 | 14.92,13.97 14.92,11.43 R5.1 15.38,10.77 VT2.E | 32.07,4.34 JP1.P$1 v32.05,10.16 | 14.92,13.97 15.81,14.86 IC2.3 v15.93,14.86
  Top 0.813: 43.91,13.97 47.29,13.97 v48.56,15.24 | v65.71,54.61 67.36,53 VT4.3
  Top 1.016: IC3.5 43.91,13.97 C2.+ 40.93,11.41 39.67,10.16 C1.1 | 32.07,4.34 35.13,4.34 38.4,7.62 38.4,9.84
  Bottom 0.508: 31.95,4.34 JP1.P$1 | v15.93,14.86 15.93,8.89 21.89,8.89 23.16,10.16 v32.05,10.16
  Bottom 0.813: v48.56,15.24 48.56,24.13 56.44,33.02 56.44,44.45 62.15,50.42 62.53,53.34 63.8,54.61 v65.71,54.61
VIBRO  (via drill 0.6)
  Top 0.305: IC1.15 35.07,51.28 v35.86,52.07 | v49.83,39.37 62.53,39.37 JP6.P$1
  Bottom 0.305: v35.86,52.07 37.13,52.07 v49.83,39.37